# Altium project esp32_schematic.PrjPcb
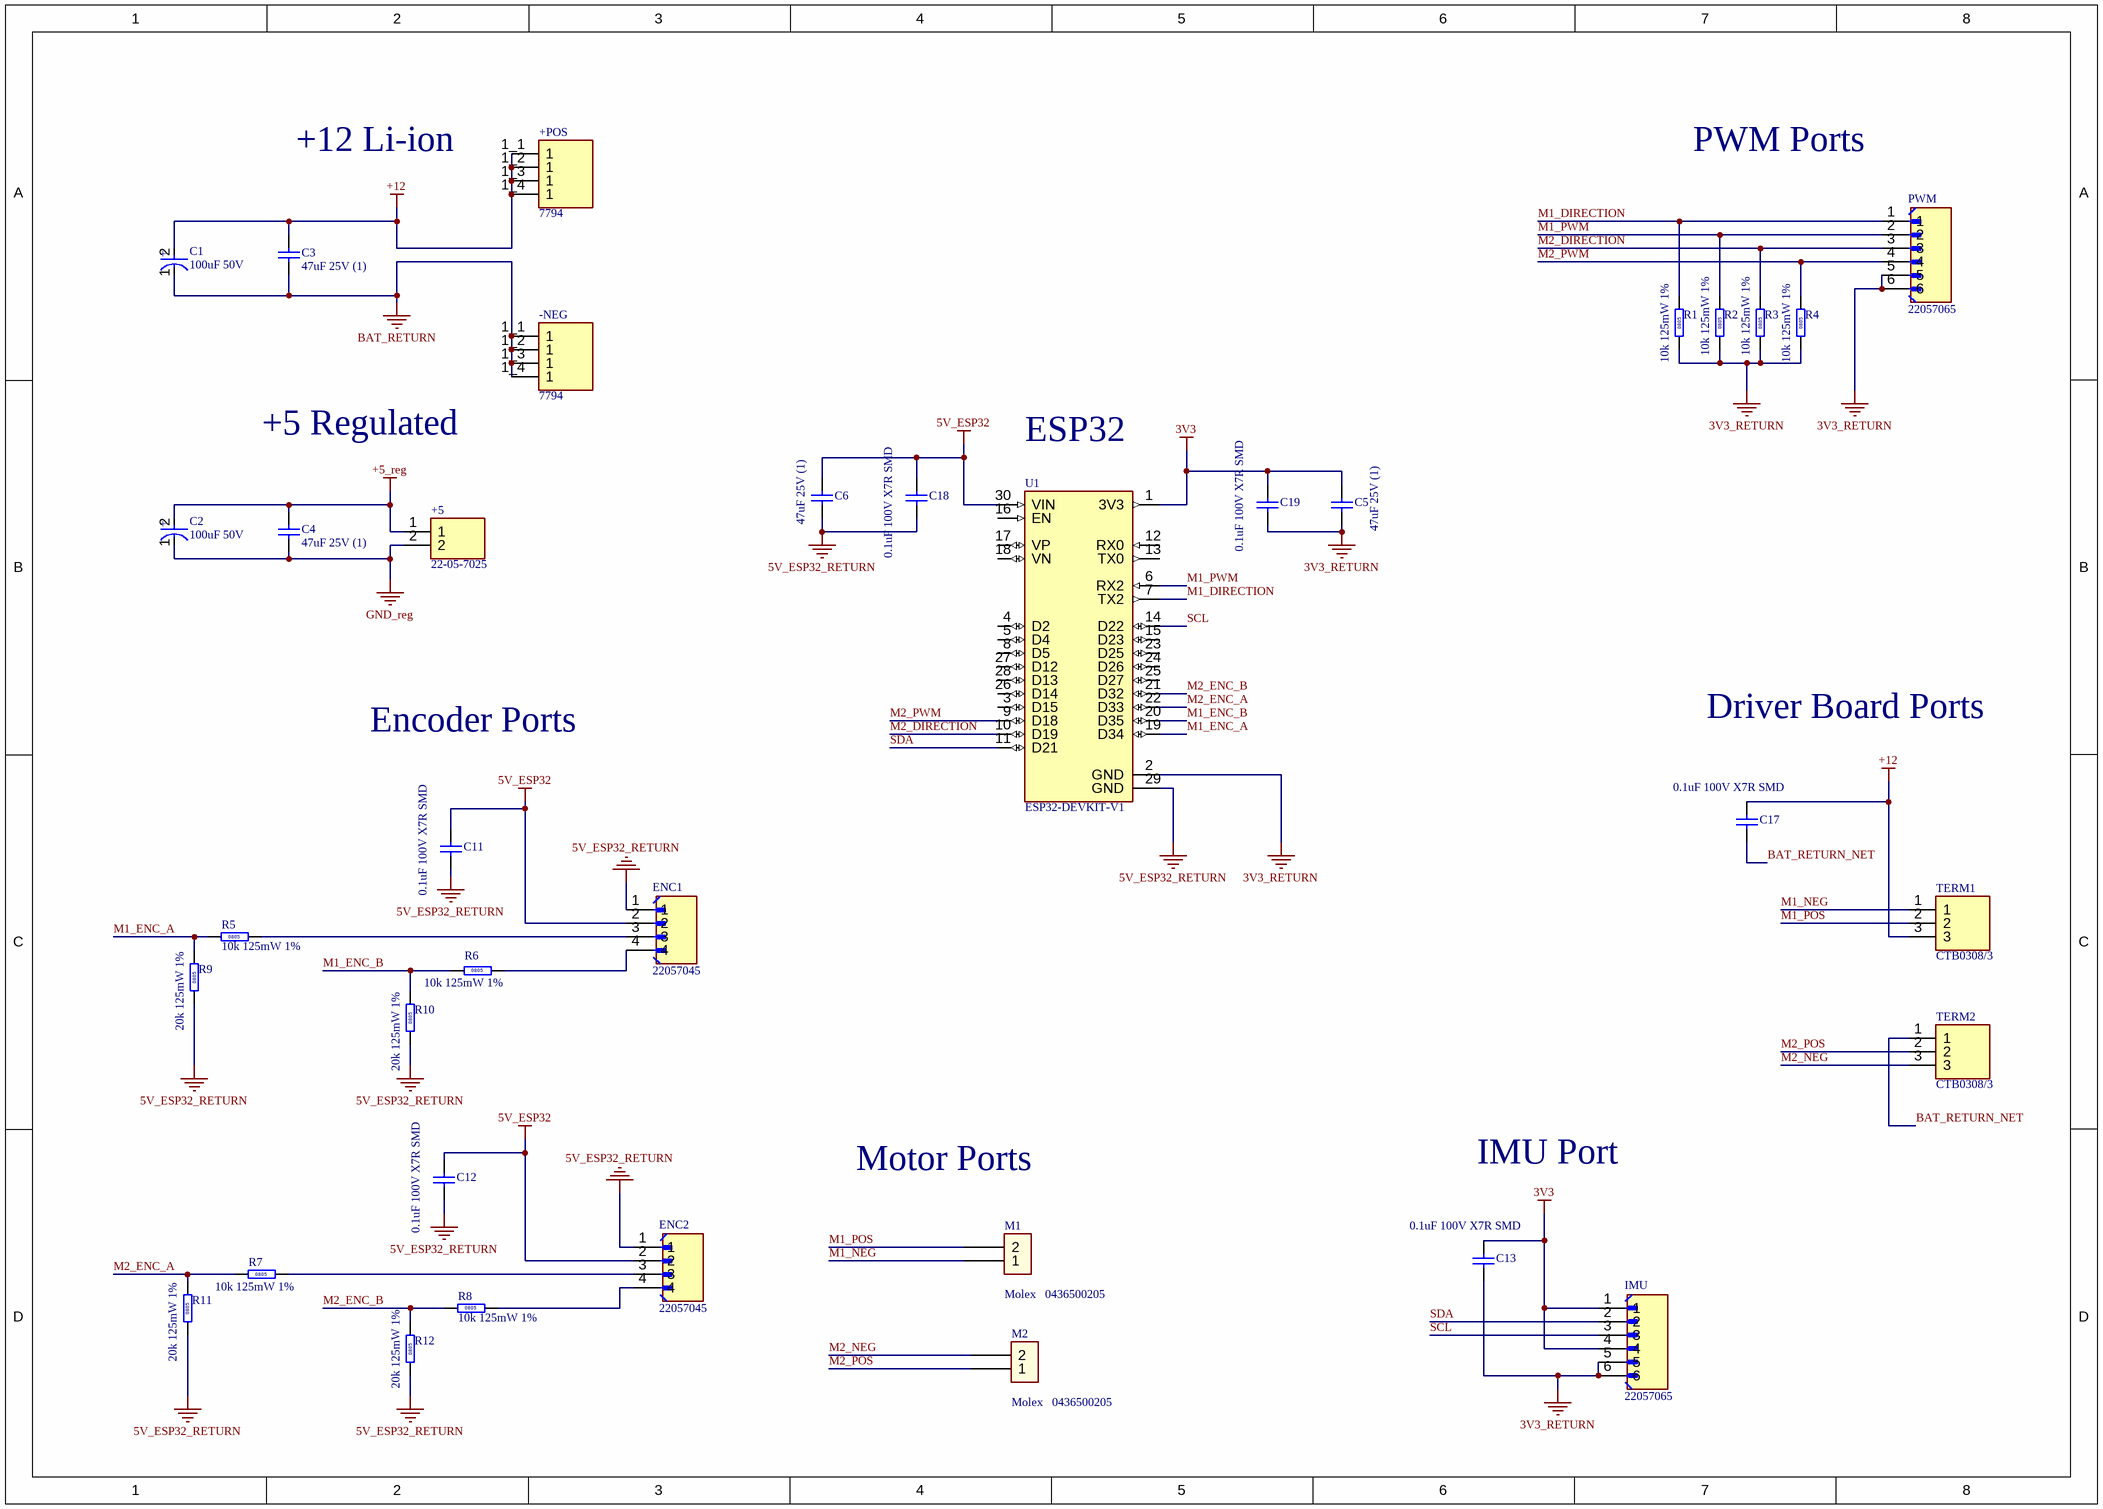
[diagram p0: esp32.SchDoc]
2 sheets, 50 parts. Net scope: global (net labels, ports and power ports of the same name join across sheets).
Board file: esp32_pcb.PcbDoc
Sheets:
  esp32.SchDoc
  power_on.SchDoc

## Sheet esp32.SchDoc
size A3; SheetNumber: 1; SheetTotal: 2

### Parts
+5  22-05-7025  [MOLEX_22-05-7025]
+POS  7794  [KEYSTONE_7794]
-NEG  7794  [KEYSTONE_7794]
C1  100uF 50V  [FP-SF-MFG]
C2  100uF 50V  [FP-SF-MFG]
C3  47uF 25V (1)  [1206 CAP]
C4  47uF 25V (1)  [1206 CAP]
C5  47uF 25V (1)  [1206 CAP]
C6  47uF 25V (1)  [1206 CAP]
C11  0.1uF 100V X7R SMD  [FP-C1206C-EB-MFG]
C12  0.1uF 100V X7R SMD  [FP-C1206C-EB-MFG]
C13  0.1uF 100V X7R SMD  [FP-C1206C-EB-MFG]
C17  0.1uF 100V X7R SMD  [FP-C1206C-EB-MFG]
C18  0.1uF 100V X7R SMD  [FP-C1206C-EB-MFG]
C19  0.1uF 100V X7R SMD  [FP-C1206C-EB-MFG]
ENC1  22057045  [MOLEX_22057045]
ENC2  22057045  [MOLEX_22057045]
IMU  22057065  [MOLEX_22057065]
M1  Molex / 0436500205  [MOLEX-0436500205]
M2  Molex / 0436500205  [MOLEX-0436500205]
PWM  22057065  [MOLEX_22057065]
R1  10k 125mW 1%  [RESC2013X60X35ML10T20]
R2  10k 125mW 1%  [RESC2013X60X35ML10T20]
R3  10k 125mW 1%  [RESC2013X60X35ML10T20]
R4  10k 125mW 1%  [RESC2013X60X35ML10T20]
R5  10k 125mW 1%  [RESC2013X60X35ML10T20]
R6  10k 125mW 1%  [RESC2013X60X35ML10T20]
R7  10k 125mW 1%  [RESC2013X60X35ML10T20]
R8  10k 125mW 1%  [RESC2013X60X35ML10T20]
R9  20k 125mW 1%  [RESC2013X60X35ML10T20]
R10  20k 125mW 1%  [RESC2013X60X35ML10T20]
R11  20k 125mW 1%  [RESC2013X60X35ML10T20]
R12  20k 125mW 1%  [RESC2013X60X35ML10T20]
TERM1  CTB0308/3  [CTB0308_3-Footprint-1]
TERM2  CTB0308/3  [CTB0308_3-Footprint-1]
U1  ESP32-DEVKIT-V1  [MODULE_ESP32_DEVKIT_V1]

### Nets
3V3: C5.2 C13.2 C19.2 IMU.1 IMU.4 U1.1(3V3)
3V3_RETURN: C5.1 C13.1 C19.1 IMU.5 IMU.6 PWM.5 PWM.6 R1.1 R2.1 R3.1 R4.1 U1.2(GND)
5V_ESP32: C6.2 C11.2 C12.2 C18.2 ENC1.2 ENC2.2 U1.30(VIN)
5V_ESP32_RETURN: C6.1 C11.1 C12.1 C18.1 ENC1.1 ENC2.1 R9.1 R10.1 R11.1 R12.1 U1.29(GND)
+5_reg: +5.1 C2.2(A) C4.2
+12: +POS.1_1(1) +POS.1_2(1) +POS.1_3(1) +POS.1_4(1) C1.2(A) C3.2 C17.2 TERM1.3
BAT_RETURN: -NEG.1_1(1) -NEG.1_2(1) -NEG.1_3(1) -NEG.1_4(1) C1.1(C) C3.1
GND_reg: +5.2 C2.1(C) C4.1
BAT_RETURN_NET: C17.1 TERM2.1
M1_DIRECTION: PWM.1 R1.2 U1.7(TX2)
M1_ENC_A: R5.1 R9.2 U1.19(D34)
M1_ENC_B: R6.1 R10.2 U1.20(D35)
M1_NEG: M1.1 TERM1.1
M1_POS: M1.2 TERM1.2
M1_PWM: PWM.2 R2.2 U1.6(RX2)
M2_DIRECTION: PWM.3 R3.2 U1.10(D19)
M2_ENC_A: R7.1 R11.2 U1.22(D33)
M2_ENC_B: R8.1 R12.2 U1.21(D32)
M2_NEG: M2.2 TERM2.3
M2_POS: M2.1 TERM2.2
M2_PWM: PWM.4 R4.2 U1.9(D18)
SCL: IMU.3 U1.14(D22)
SDA: IMU.2 U1.11(D21)
NetENC1_3: ENC1.3 R5.2
NetENC1_4: ENC1.4 R6.2
NetENC2_3: ENC2.3 R7.2
NetENC2_4: ENC2.4 R8.2

Not connected (* = marked no-connect by the designer): U1 3(D15) 4(D2) 5(D4) 8(D5) 12(RX0) 13(TX0) 15(D23) 16(EN) 17(VP) 18(VN) 23(D25) 24(D26) 25(D27) 26(D14) 27(D12) 28(D13)

### Notes on the sheet
- +12 Li-ion
- PWM Ports
- +5 Regulated
- ESP32
- Driver Board Ports
- Encoder Ports
- Motor Ports
- IMU Port
- Sheet Title
- Design Title
- Sheet
- SIZE
- A3
- Designer
- PCB Code
- PCB Rev
- Approver
- Assembly Code
- Issue
- EC No.
- Approved Date
- (in symbol CMP-40-005-00116-1) +

### Library data of the parts
+5 = 22-05-7025: Header 2.5mm SPOX, WTB, RA, F/lock, 2w | Molex Incorporated 22-05-7025; SnapEDA_Link: https://www.snapeda.com/parts/22-05-7025/Molex/view-part/?ref=snap; Package: None; Value: *; MF: Molex; MP: 22-05-7025; Check_prices: https://www.snapeda.com/parts/22-05-7025/Molex/view-part/?ref=eda
+POS -NEG = 7794: PC SCREW TERMINAL | Keystone Electronics 7794; SnapEDA_Link: https://www.snapeda.com/parts/7794/Keystone/view-part/?ref=snap; Package: None; Value: *; MF: Keystone Electronics; MP: 7794; Check_prices: https://www.snapeda.com/parts/7794/Keystone/view-part/?ref=eda
C1 C2 = CMP-40-005-00116-1: Cap, SMD, Electrolytic Capacitor, Polarized, Aluminum (wet), 50V, 20% +Tol, 20% -Tol, 100uF, Surface Mount, 3333; Manufacturer: Panasonic; ManufacturerPartNumber: EEE-1HA101UP; Leakage Current: 50uA; Value: 100µF; ComponentLinkDescription: Datasheet; Capacitor Type: Aluminium; Tan Delta: 0.12; Ripple Current: 200mA; Pins: 2; Height: 10.2mm; CapacitorType: Electrolytic; Termination: Flat; Maximum Operating Temperature: 85°C; Minimum Operating Temperature: -40°C; Tolerance  (fill in as +-): 20%; Rated DC Voltage (URdc): 50V; Polarity: Polarized; Width: 8.3mm; Length: 10mm; RoHS Compliant: Yes; JESD-609 Code: e3,e6; Reach SVHC Compliant: Yes; Packaging: Tape and Reel; Tolerance: 20%; ComponentLinkURL: https://industrial.panasonic.com/ww; Package Style: SMTMeter; Terminal Finish: Tin; Package Shape: Cylindrical; DielectricType: Electrolytic; Mounting Technology: Surface Mount; Package: 3333; VoltageRating: 50V; Dielectric Material: Aluminium; MountingType: SMD; Case/Package: 3333; Tolerance (fill in as +-): 20%
C3-C6 = CMP-40-005-00079-2: Ceramic Capacitor, Multilayer, Ceramic, 25V, 20% +Tol, 20% -Tol, X5R, 15% TC, 47uF, Surface Mount, 1206; ManufacturerPartNumber: C3216X5R1E476M160AC; Manufacturer: TDK; Value: 47µF; ComponentLinkDescription: Datasheet; Multilayer: Yes; Temperature Characteristics Code: X5R; Length: 3.2mm; Tolerance  (fill in as +-): 20%; DielectricType: X5R; Tolerance: 20%; Package Shape: Rectangular; Packaging: Tape and Reel; Mounting Technology: Surface Mount; MountingType: SMD; Pins: 2; Rated DC Voltage (URdc): 25V; RoHS Compliant: Yes; Capacitor Type: Ceramic; Dielectric Material: Ceramic; Width: 1.6mm; Termination: Wraparound; JESD-609 Code: e3; Min Operating Temperature: -55°C; Terminal Finish: Nickel; Height: 1.6mm; Package: 1206; CapacitorType: Ceramic; Package Style: SMTMeter; Max Operating Temperature: 85°C; Tolerance (fill in as +-): 20%; Reach SVHC Compliant: Yes; Case/Package: 1206; ComponentLinkURL: https://datasheet.ciiva.com/pdfs/VipMasterIC/IC/TDKC/TDKC-S-A0008796792/TDKC-S-A0008796792-1.pdf?src-supplier=IHS+Markit; VoltageRating: 25V
C11-C13 C17-C19 = CMP-40-005-00046-8: Cap, SMD, 0.1uF, 100V, 10%, 1206, X7R; ManufacturerPartNumber: C1206C104K1RAC7800; Manufacturer: KEMET; CapacitorType: Ceramic; ComponentLinkDescription: Datasheet; Value: 100nF; Case/Package: 1206; Min Operating Temperature: -55; DielectricType: X7R; Tolerance: 10%; Width: 1.6mm; Packaging: Tape and Reel; Minimum Operating Temperature: -55°C; Max Operating Temperature: 125; Case Code (Imperial): 1206; VoltageRating: 100V; Height: 0.88mm; MountingType: SMD; Length: 3.2mm; Package: 1206; Maximum Operating Temperature: 125°C; Voltage: 100V; ComponentLinkURL: https://www.mouser.com/datasheet/2/212/KEM_C1002_X7R_SMD-1102033.pdf; Series: C1206C; Case Code (Metric): 3216; Package Quantity: 4000; Termination: SMD/SMT; Voltage Rating: 100V; Material: Ceramic; Voltage Rating (DC): 100V; Dielectric: X7R; RoHS Compliant: Yes
ENC1 ENC2 = CMP-40-050-00027-5: 2.50mm Pitch, Mini-SPOX PCB Header, Single Row, Through Hole, Tin Plating, Friction Lock, 4 Circuits, Bag, 3.50mm PC Tail Length; Number of Ways: None; ComponentLinkURL: 22057045.SchLib; ConnectorType: Standard; MountingType: None; Contact Gender: Male; Availability: Unavailable; Pin Count: 4; Package: None; Jack/Receptacle: 2.50mm Pitch, Mini-SPOX PCB Header, Single Row, Through Hole, Tin Plating, Friction Lock, 4 Circuits, Bag, 3.50mm PC Tail Length; Value: *; Component Type: Standard; ManufacturerPartNumber: 22057045; ComponentLinkDescription: 22057045.SchLib; Price: None; Manufacturer: 22057045; MP: 22057045; Source: 22057045.SchLib; Number of Rows: 4; Design Item ID: 22057045
IMU PWM = 22057065: Conn Shrouded Header (4 Sides) HDR 6 POS 2.5mm Solder RA Side Entry Thru-Hole SPOXâ„¢ Bag; MF: Molex; SnapEDA_Link: https://www.snapeda.com/parts/22057065/Molex/view-part/?ref=snap; Package: None; Value: *; MP: 22057065; Check_prices: https://www.snapeda.com/parts/22057065/Molex/view-part/?ref=eda
M1 M2 = CMP-40-050-00008-2: Conn, TH, Micro-Fit, 2 Way, 1 Row, 3mm pitch, Jack, Right-Angled; Current Rating: 8.5A; Number of Ways: 2; ComponentLinkDescription: Datasheet; VoltageRating: 250V; ComponentLinkURL: https://www.molex.com/webdocs/datasheets/pdf/en-us/0436500205_PCB_HEADERS.pdf; Connector Pitch: 3mm; Connector Orientation: Right-Angled; Jack/Receptacle: Jack; Contact Gender: Female; ManufacturerPartNumber: 0436500205; Number of Rows: 1; Manufacturer: Molex; MountingType: TH; ConnectorType: Micro-Fit
R1-R12 = CMP-40-025-00226-1: Res, SMD, 10k, 125mW, 1%, ±200ppm, 0805; Manufacturer: Panasonic; ManufacturerPartNumber: ERJ-6GEYJ103V; Package Height: 0.6mm; ComponentLinkDescription: Datasheet; Voltage Rating: 150V; Tolerance: 5%; RoHS3Certificate: https://download.siliconexpert.com/pdfs2/2024/6/2/9/59/48/925943/pns_/manual/erj6enf2700v_rohs.pdf; Composition: Thick Film; Contact Plating: Tin; Reach SVHC Compliant: Unaffected; ComponentLinkURL: https://octopart.com/erj-6geyj103v-panasonic-55422885; Temperature Coefficient (ppm/cel): ±200ppm; Resistance: 10k; Max Operating Temperature: 155°C; Mount: SMD; Number of Pins: 2; Case/Package: 0805; RoHS3Compliant: Yes (with exeption); Power Rating: 125mW; Resistor Type: Fixed; Min Operating Temperature: -55°C
TERM1 TERM2 = CMP-40-050-00115-1: Barrier Strip Terminal Block, 3 position; ManufacturerPartNumber: CTB0308_3; Manufacturer: CAMDENBOSS; VoltageRating: 130V; Number of Ways: 3; ComponentLinkDescription: Datasheet; Current Rating: 10A; Jack/Receptacle: Receptacle; ComponentLinkURL: https://datasheet.ciiva.com/pdfs/VipMasterIC/IC/CAME/CAMES00005/CAMES00005-1.pdf?src-supplier=IHS+Markit; Minimum Operating Temperature: 0°C; REACHStatement: No; Number of Rows: 1; Terminal and Terminal Block Type: BARRIER STRIP TERMINAL BLOCK; Manufacturer Series: CTB0308; RoHS3Compliant: Yes; MountingType: TH; RoHS3Certificate: Yes; ConnectorType: Terminal Block; Maximum Operating Temperature: 110°C
U1 = ESP32-DEVKIT-V1: Dual core, Wi-Fi: 2.4 GHz up to 150 Mbits/s,BLE (Bluetooth Low Energy) and legacy Bluetooth, 32 bits, Up to 240 MHz; MF: Do it; SnapEDA_Link: https://www.snapeda.com/parts/ESP32-DEVKIT-V1/Do+it/view-part/?ref=snap; Package: None; Value: *; MP: ESP32-DEVKIT-V1; Check_prices: https://www.snapeda.com/parts/ESP32-DEVKIT-V1/Do+it/view-part/?ref=eda

## Sheet power_on.SchDoc
size A4; SheetNumber: 2; SheetTotal: 2
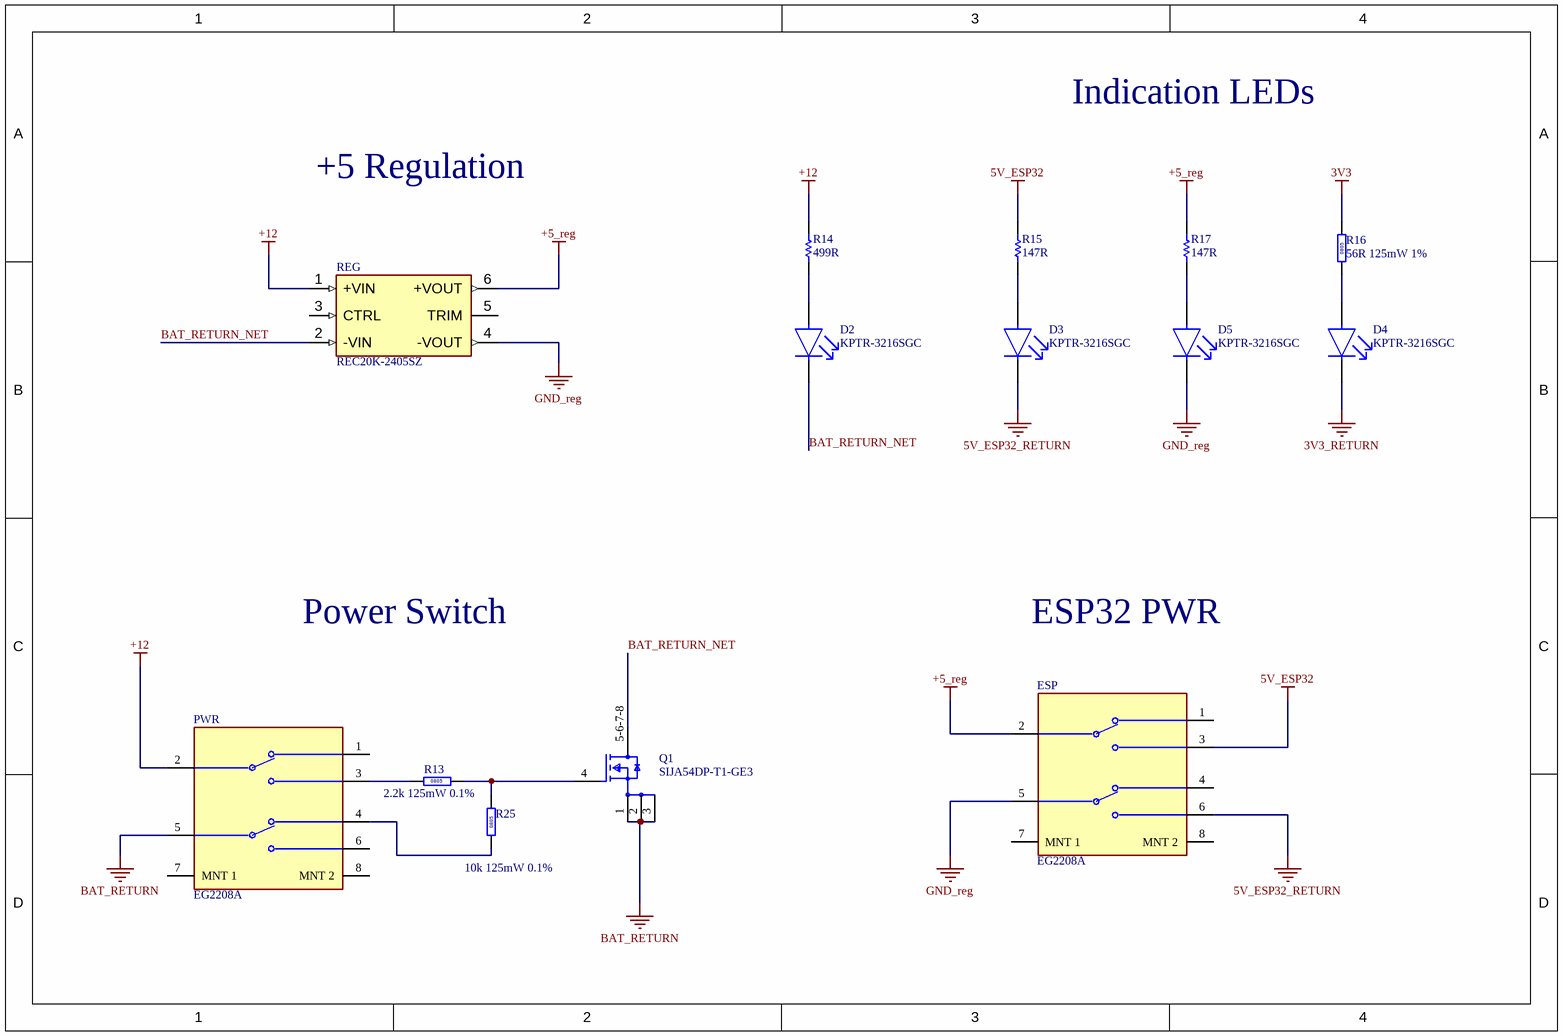
[diagram p1: power_on.SchDoc]

### Parts
D2  KPTR-3216SGC  [KPTR-3216SGC-Footprint-1]
D3  KPTR-3216SGC  [KPTR-3216SGC-Footprint-1]
D4  KPTR-3216SGC  [KPTR-3216SGC-Footprint-1]
D5  KPTR-3216SGC  [KPTR-3216SGC-Footprint-1]
ESP  EG2208A  [FP-EG2208A-MFG]
PWR  EG2208A  [FP-EG2208A-MFG]
Q1  SIJA54DP-T1-GE3  [SIJA54DP-T1-GE3-Footprint-2]
R13  2.2k 125mW 0.1%  [RESC2013X60X35ML10T20]
R14  499R  [RESC2013X60X40ML20T25]
R15  147R  [RESC2013X60X40ML20T25]
R16  56R 125mW 1%  [RESC2013X60X35ML10T20]
R17  147R  [RESC2013X60X40ML20T25]
R25  10k 125mW 0.1%  [RESC2013X60X35ML10T20]
REG  REC20K-2405SZ  [CONV_REC20K-2405SZ]

### Nets
3V3: R16.2
3V3_RETURN: D4.2(C)
5V_ESP32: ESP.3 R15.2
5V_ESP32_RETURN: D3.2(C) ESP.6
+5_reg: ESP.2(Com) R17.2 REG.6(+VOUT)
+12: PWR.2(Com) R14.2 REG.1(+VIN)
BAT_RETURN: PWR.5(Com) Q1.1(S) Q1.2(S) Q1.3(S)
GND_reg: D5.2(C) ESP.5(Com) REG.4(-VOUT)
BAT_RETURN_NET: D2.2(C) Q1.5-6-7-8(D) REG.2(-VIN)
NetD2_1: D2.1(A) R14.1
NetD3_1: D3.1(A) R15.1
NetD4_1: D4.1(A) R16.1
NetD5_1: D5.1(A) R17.1
NetPWR_3: PWR.3 R13.1
NetPWR_4: PWR.4 R25.1
NetQ1_4: Q1.4(G) R13.2 R25.2

Not connected (* = marked no-connect by the designer): ESP 1 4 7(MNT_1) 8(MNT_2); PWR 1 6 7(MNT_1) 8(MNT_2); REG 3(CTRL) 5(TRIM)

### Notes on the sheet
- Indication LEDs
- +5 Regulation
- Power Switch
- ESP32 PWR
- Sheet Title
- Design Title
- Sheet
- SIZE
- A4
- Designer
- PCB Code
- PCB Rev
- Approver
- Assembly Code
- Issue
- EC No.
- Approved Date

### Library data of the parts
D2-D5 = CMP-40-060-00012-7: Single Color LED, Super Bright Green, Water Clear, 1.6mm; Manufacturer: Kingbright; Reverse Voltage-Max: 5V; Overall Height: 1.05mm; Channels: 1; Luminous Intensity-Nom: 15mcd; Forward Voltage: 2.5V; Shape: Rectangular; Luminous Intensity-Min: 120cd; Viewing Angle: 120°; Forward Current: 25mA; ComponentLinkDescription: Datasheet; Terminal Pitch: 3.6mm; Size: 1.6mm; Colour: Super Bright Green; Min Operating Temperature: -40°C; Max Operating Temperature: 85°C; Package: 1206; ComponentLinkURL: https://datasheet.ciiva.com/pdfs/VipMasterIC/IC/KNGB/KNGBS03251/KNGBS03251-1.pdf?src-supplier=IHS+Markit; RoHS Compliant: Yes; Color@wavelength: Green; Maximum Operating Temperature: 85°C; Packaging: Tape and Reel; Minimum Operating Temperature: -40°C; ManufacturerPartNumber: KPTR-3216SGC; Pins: 2; Optoelectronic Device Type: SINGLE COLOR LED; Color: Green; MountingType: SMD; Reach SVHC Compliant: Yes; ForwardVoltage: 2.5V; Lens Style: WATER CLEAR; Mounting Technology: Surface Mount
ESP PWR = CMP-17877-000003-1: SWITCH SLIDE DPDT 200MA 30V; Switch Travel: 2mm; Actuator Type: Standard; Switch Function: On-On; Actuator Length: 6mm; Operating Force: 200gf; Illumination Type: Non-Illuminated; Electrical Life: 10000Cycles; Number of Positions: 2; Contact Current Rating: 200mA; Contact Material: Copper Alloy; Throw Configuration: DPDT; RoHS Compliant: Yes; Lead Free: Lead Free; Termination: PC Pin; Package Quantity: 800; Current Rating: 200mA; REACH SVHC: No SVHC; Max Operating Temperature: 70°C; Min Operating Temperature: -25°C; Contact Plating: Silver; Voltage Rating (DC): 30V; Voltage Rating (AC): 30V; Mount: Through Hole; Orientation: Right Angle; Packaging: Bulk; Series: EG
Q1 = CMP-40-040-00025-2: Transistor, SMD, MOSFET, N-Chan, 40V; Manufacturer: Vishay; ComponentLinkDescription: Datasheet; CurrentRating: 60A; PowerRating: 36.7W; Minimum Operating Temperature: -55°C; Package: PowerPak SO-8; Breakdown Voltage: 40V; RoHS3Compliant: Yes; Maximum Operating Temperature: 150°C; TransistorType: MOSFET, N-Chan; ComponentLinkURL: https://datasheet.ciiva.com/pdfs/VipMasterIC/IC/VISH/VISH-S-A0002290573/VISH-S-A0002281459-1.pdf?src-supplier=IHS+Markit; MountingType: SMD; ManufacturerPartNumber: SIJA54DP-T1-GE3
R13 R25 = CMP-40-025-00231-1: Res, SMD, 100k, 125mW, 0.1%, ±25ppm, 0805; Manufacturer: Panasonic; ManufacturerPartNumber: ERA-6AEB104V; Voltage Rating: 100V; ComponentLinkDescription: Datasheet; Package Height: 0.6; Power Rating: 125mW; Resistor Type: Fixed; RoHS3Certificate: https://download.siliconexpert.com/pdfs2/2024/6/2/9/59/48/925943/pns_/manual/erj6enf2700v_rohs.pdf; Mount: SMD; Case/Package: 0805; Composition: Thin Film; Temperature Coefficient (ppm/cel): ±25ppm; Min Operating Temperature: -55°C; ComponentLinkURL: https://octopart.com/era-6aeb104v-panasonic-1193246; Tolerance: 0.1%; Number of Pins: 2; Reach SVHC Compliant: Unaffected; RoHS3Compliant: Yes (with excemption); Contact Plating: Tin; Max Operating Temperature: 155°C; Resistance: 100k
R14 R15 R17 = CMP-2001-00837-1: Part Number: ERA6AEB4990V; Manufacturer: Panasonic
R16 = CMP-40-025-00232-1: Res, SMD, 56R, 125mW, 1%, ±100ppm, 0805; Manufacturer: Panasonic; ManufacturerPartNumber: ERJ-6ENF56R0V; Voltage Rating: 150V; ComponentLinkDescription: Datasheet; Package Height: 0.6; Resistance: 56; Tolerance: 1%; Composition: Thick Film; ComponentLinkURL: https://octopart.com/erj-6enf56r0v-panasonic-10475342; Resistor Type: Fixed; RoHS3Compliant: Yes (with excemption); Max Operating Temperature: 155°C; Contact Plating: Tin; Power Rating: 125mW; Number of Pins: 2; Case/Package: 0805; Temperature Coefficient (ppm/cel): ±100ppm; Min Operating Temperature: -55°C; RoHS3Certificate: https://download.siliconexpert.com/pdfs2/2024/6/2/9/59/48/925943/pns_/manual/erj6enf2700v_rohs.pdf; Mount: SMD; Reach SVHC Compliant: Unaffected
REG = REC20K-2405SZ: MF: Recom Power; Package: None; Price: None; Value: *; MP: REC20K-2405SZ; Availability: Unavailable

## Nets that join several sheets
3V3: esp32 (6 pins), power_on (R16.2)
3V3_RETURN: esp32 (12 pins), power_on (D4.2)
5V_ESP32: esp32 (7 pins), power_on (ESP.3 R15.2)
5V_ESP32_RETURN: esp32 (11 pins), power_on (D3.2 ESP.6)
+5_reg: esp32 (+5.1 C2.2 C4.2), power_on (ESP.2 R17.2 REG.6)
+12: esp32 (8 pins), power_on (PWR.2 R14.2 REG.1)
BAT_RETURN: esp32 (6 pins), power_on (PWR.5 Q1.1 Q1.2 Q1.3)
GND_reg: esp32 (+5.2 C2.1 C4.1), power_on (D5.2 ESP.5 REG.4)
BAT_RETURN_NET: esp32 (C17.1 TERM2.1), power_on (D2.2 Q1.5-6-7-8 REG.2)